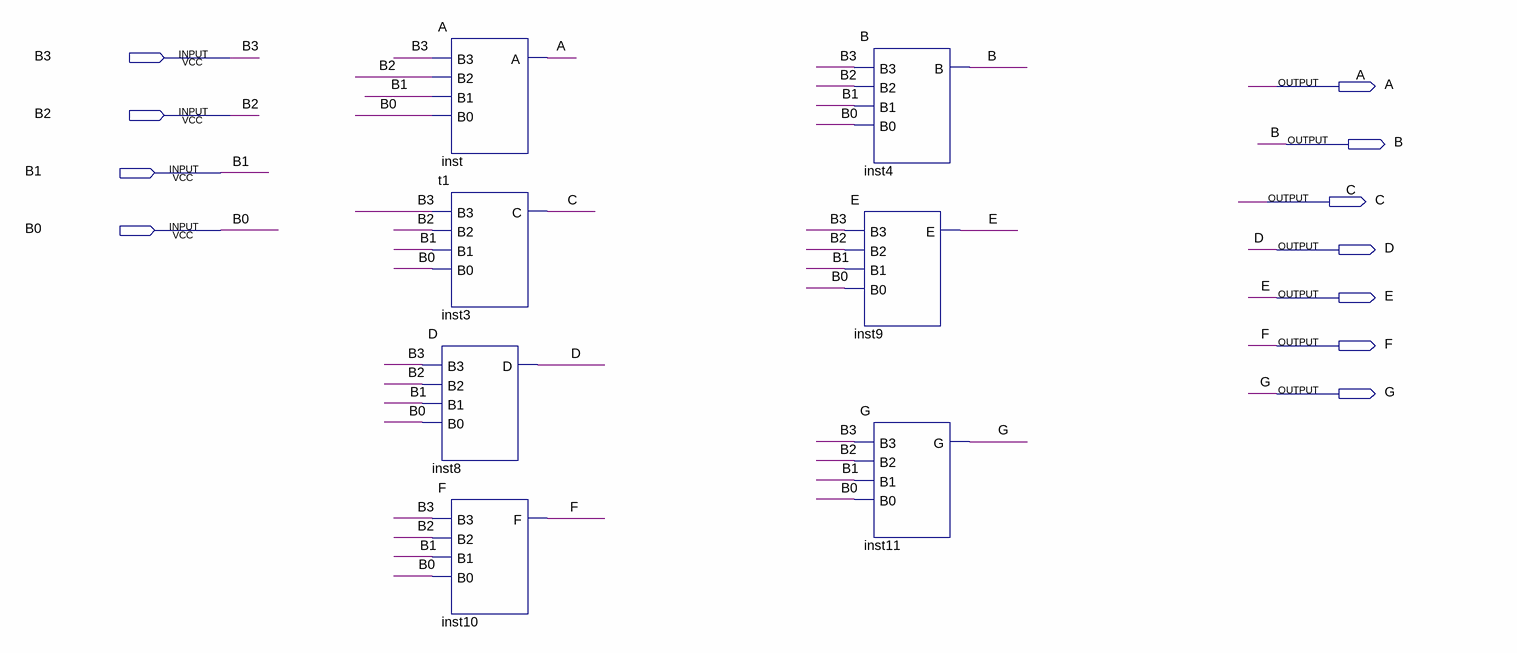
[diagram p0: schematic sheet]
// Quartus schematic BCD7.bdf as structural Verilog: 7 symbols, 11 pins
module BCD7 (
  input  B3,
  input  B2,
  input  B1,
  input  B0,
  output A,
  output B,
  output C,
  output D,
  output E,
  output F,
  output G
);

  A inst (.B3(B3), .B2(B2), .B1(B1), .B0(B0), .A(A));
  t1 inst3 (.B3(B3), .B2(B2), .B1(B1), .B0(B0), .C(C));
  D inst8 (.B3(B3), .B2(B2), .B1(B1), .B0(B0), .D(D));
  F inst10 (.B3(B3), .B2(B2), .B1(B1), .B0(B0), .F(F));
  B inst4 (.B3(B3), .B2(B2), .B1(B1), .B0(B0), .B(B));
  E inst9 (.B3(B3), .B2(B2), .B1(B1), .B0(B0), .E(E));
  G inst11 (.B3(B3), .B2(B2), .B1(B1), .B0(B0), .G(G));
endmodule
